# Altium schematic sheet Sensors_and_External_Interfaces.SchDoc
size A4; DocumentNumber: 4; SheetNumber: 4; SheetTotal: 4
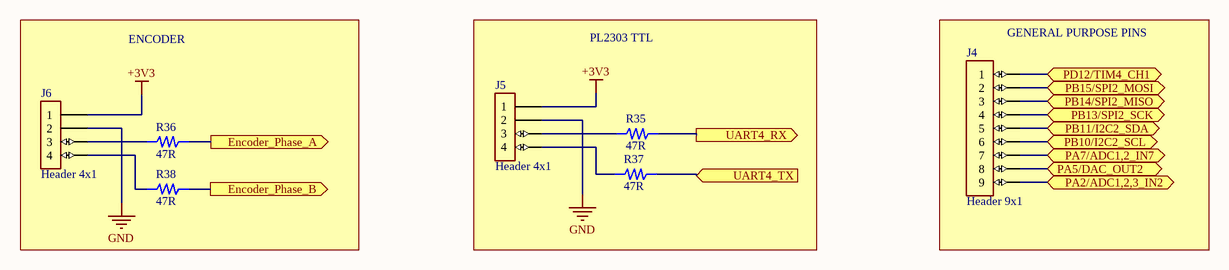
[diagram p0: Sensors_and_External_Interfaces.SchDoc]

## Parts
J4  Header 9x1  [9x1 Header]
J5  Header 4x1  [4x1 Header]
J6  Header 4x1  [4x1 Header]
R35  47R  [ROYALOHM 0603 RES]
R36  47R  [ROYALOHM 0603 RES]
R37  47R  [ROYALOHM 0603 RES]
R38  47R  [ROYALOHM 0603 RES]

## Blocks framed on the sheet
ENCODER: J6 R36 R38
PL2303 TTL: J5 R35 R37
GENERAL PURPOSE PINS: J4

## Ports
Encoder_Phase_A (out, see MCU[1D]), Encoder_Phase_B (out, see MCU[1D]), PA2/ADC1,2,3_IN2 (bidir, see MCU[1D]), PA5/DAC_OUT2 (bidir, see MCU[1D]), PA7/ADC1,2_IN7 (bidir, see MCU[1D]), PB10/I2C2_SCL (bidir, see MCU[2D]), PB11/I2C2_SDA (bidir, see MCU[2D]), PB13/SPI2_SCK (bidir, see MCU[2D]), PB14/SPI2_MISO (bidir, see MCU[2D]), PB15/SPI2_MOSI (bidir, see MCU[2D]), PD12/TIM4_CH1 (bidir, see MCU[3B]), UART4_RX (out, see MCU[3B]), UART4_TX (in, see MCU[3B])

## Nets
+3V3: J5.1 J6.1
GND: J5.2 J6.2
Encoder_Phase_A: R36.2 ; port Encoder_Phase_A
Encoder_Phase_B: R38.2 ; port Encoder_Phase_B
PA2/ADC1,2,3_IN2: J4.9 ; port PA2/ADC1,2,3_IN2
PA5/DAC_OUT2: J4.8 ; port PA5/DAC_OUT2
PA7/ADC1,2_IN7: J4.7 ; port PA7/ADC1,2_IN7
PB10/I2C2_SCL: J4.6 ; port PB10/I2C2_SCL
PB11/I2C2_SDA: J4.5 ; port PB11/I2C2_SDA
PB13/SPI2_SCK: J4.4 ; port PB13/SPI2_SCK
PB14/SPI2_MISO: J4.3 ; port PB14/SPI2_MISO
PB15/SPI2_MOSI: J4.2 ; port PB15/SPI2_MOSI
PD12/TIM4_CH1: J4.1 ; port PD12/TIM4_CH1
UART4_RX: R35.2 ; port UART4_RX
UART4_TX: R37.2 ; port UART4_TX
NetJ5_3: J5.3 R35.1
NetJ5_4: J5.4 R37.1
NetJ6_3: J6.3 R36.1
NetJ6_4: J6.4 R38.1

## Library data of the parts
J4 = Header 9x1: PIN HEADER 5PIN (5x1) 2.54mm THT V/T; Manufacturer: CONNFLY; Manufacturer Code: DS1021-1X9SF11-B; Pin Overall Length: 15.04 mm; Pin Spacing: 2.54 mm; Insulation Height: 2.5 mm; Mounting Type: THT V/T; Manufacturer Site: https://www.ozdisan.com/en/p/pin-headers-293/connfly-ds1021-1x9sf11-b-421995https://www.ozdisan.com/en/p/pin-headers-293/connfly-ds1021-1x9sf11-b-421995
J5 J6 = Header 4x1 for Encoder: PIN HEADER 5PIN (4x1) 2.54mm THT V/T; Manufacturer: AMPHENOL; Manufacturer Code: 68000-404HLF; Pin Overall Length: 15.04 mm; Insulation Height: 2.5 mm; Pin Spacing: 2.54 mm; Manufacturer Site: https://www.ozdisan.com/p/pin-headerlar-293/amphenol-68000-404hlf-1056428
R35-R38 = RES 0603 47R: RES. 0603 47 Ohms 1% 1/8W-S 100PPM; Manufacturer Code: CQ03SAJ0470T5E; Manufacturer: ROYALOHM; Power: 1/8W; Tolerance: %1; Voltage Rating: 150V; Resistance Value: 47 Ohms; Manufacturer Site: https://www.ozdisan.com/p/smt-smd-ve-cip-direncler-194/royalohm-cq03saj0470t5e-587918; Package Size: 0603